# EAGLE design main (EAGLE 6.3)
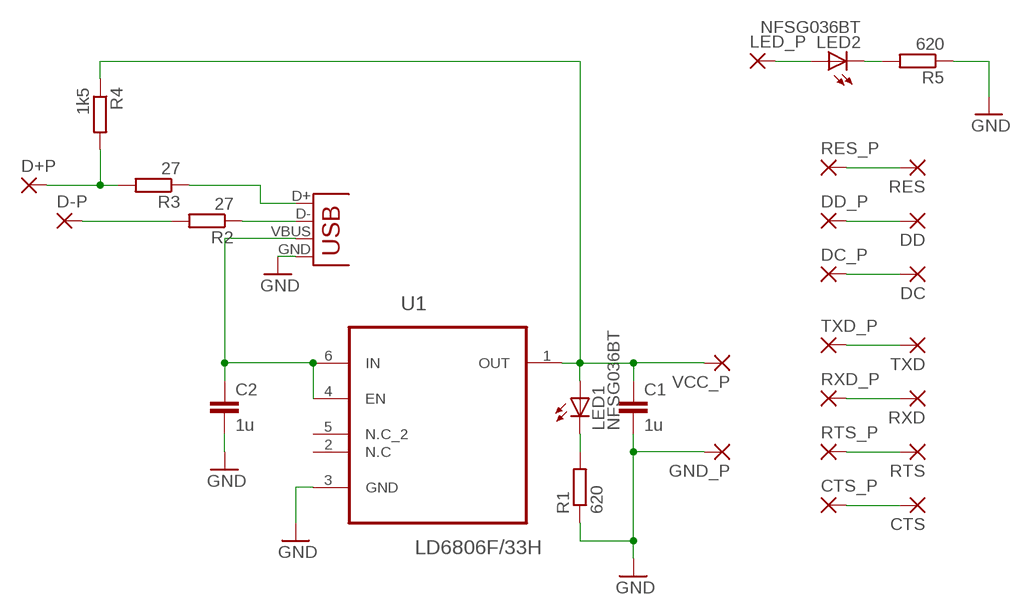
[diagram p0: schematic, sheet 1]

## Parts
C1  1u  C-EUC0805  [C0805]
C2  1u  C-EUC0805  [C0805]
CTS  WIREPAD1,6/0,8  [1,6/0,8]
CTS_P  WIREPAD1,6/0,8  [1,6/0,8]
D+P  WIREPAD1,6/0,8  [1,6/0,8]
D-P  WIREPAD1,6/0,8  [1,6/0,8]
DC  WIREPAD1,6/0,8  [1,6/0,8]
DC_P  WIREPAD1,6/0,8  [1,6/0,8]
DD  WIREPAD1,6/0,8  [1,6/0,8]
DD_P  WIREPAD1,6/0,8  [1,6/0,8]
GND_P  WIREPAD1,6/0,8  [1,6/0,8]
LED1  NFSG036BT  [NFSG036BT]
LED2  NFSG036BT  [NFSG036BT]
LED_P  WIREPAD1,6/0,8  [1,6/0,8]
R1  620  R-EU_R0805  [R0805]
R2  27  R-EU_R0805  [R0805]
R3  27  R-EU_R0805  [R0805]
R4  1k5  R-EU_R0805  [R0805]
R5  620  R-EU_R0805  [R0805]
RES  WIREPAD1,6/0,8  [1,6/0,8]
RES_P  WIREPAD1,6/0,8  [1,6/0,8]
RTS  WIREPAD1,6/0,8  [1,6/0,8]
RTS_P  WIREPAD1,6/0,8  [1,6/0,8]
RXD  WIREPAD1,6/0,8  [1,6/0,8]
RXD_P  WIREPAD1,6/0,8  [1,6/0,8]
TXD  WIREPAD1,6/0,8  [1,6/0,8]
TXD_P  WIREPAD1,6/0,8  [1,6/0,8]
U1  LD6806F/33H  [SON50P100X145X50-6N]
VCC_P  WIREPAD1,6/0,8  [1,6/0,8]
X1  USB-MICROB  [USB-MICROB]

## Nets
3V3: C1.1 LED1.A R4.1 U1.1(OUT) VCC_P.1(P)
5V: C2.1 U1.4(EN) U1.6(IN) X1.VBUS
GND: C1.2 C2.2 GND_P.1(P) R1.1 R5.1 U1.3(GND) X1.GND
N$1: D+P.1(P) R3.2 R4.2
N$2: R3.1 X1.D+
N$3: DD.1(P) DD_P.1(P)
N$4: DC.1(P) DC_P.1(P)
N$5: TXD.1(P) TXD_P.1(P)
N$6: RXD.1(P) RXD_P.1(P)
N$7: RTS.1(P) RTS_P.1(P)
N$8: CTS.1(P) CTS_P.1(P)
N$9: LED1.C R1.2
N$10: R2.1 X1.D-
N$11: D-P.1(P) R2.2
N$12: LED2.A LED_P.1(P)
N$13: LED2.C R5.2
N$14: RES.1(P) RES_P.1(P)
Unconnected: U1.2(N.C) U1.5(N.C_2)

## Library data of the parts
C1 C2 = resistor:C-EU: CAPACITOR, European symbol
CTS CTS_P D+P D-P DC DC_P DD DD_P GND_P LED_P RES RES_P RTS RTS_P RXD RXD_P TXD TXD_P VCC_P = wirepad:WIREPAD: Wire PAD connect wire on PCB
LED1 LED2 = led:NFSG036BT: CHIP TYPE GREEN LED NFSx036xT Source: NICHIA CORPORATION .. NFSG036BT-E.pdf
R1-R5 = resistor:R-EU_: RESISTOR, European symbol
U1 = NXP_By_element14_Batch_1:LD6806F/33H: Ultra low-dropout regulator; MPN: LD6806F/33H; OC_FARNELL: 2057263; OC_NEWARK: 64T3344; PACKAGE: SON-6; SUPPLIER: NXP
X1 = SparkFun:USB: USB Connectors USB-B-PTH is fully proven SKU : PRT-00139 USB-miniB is fully proven SKU : PRT-00587 USB-A-PCB is untested. USB-A-H is throughly reviewed, but untested. Spark Fun Electronics SKU : PRT-00437 USB-B-SMT is throughly reviewed, but untested. Needs silkscreen touching up. USB-A-S has not been used/tested USB-MB-H has not been used/tested

## Board
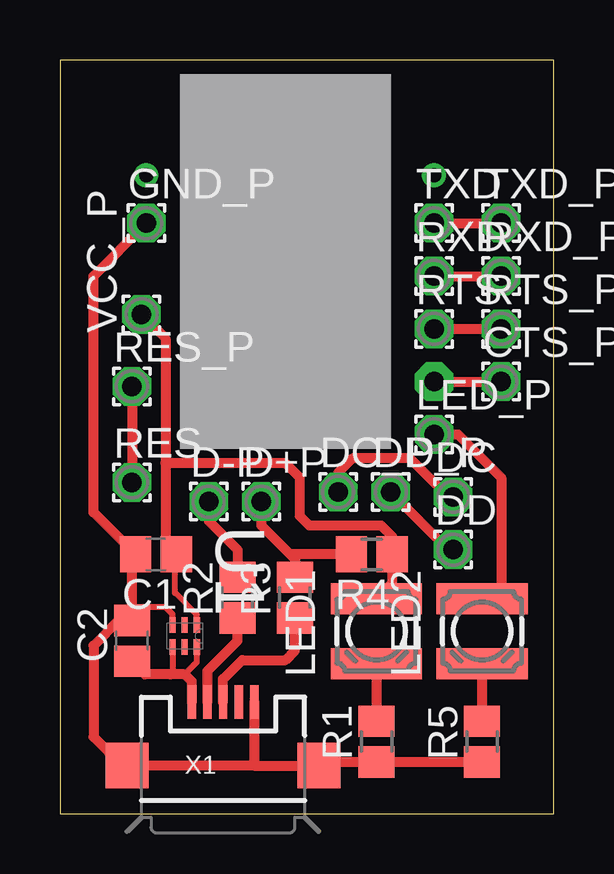
[diagram p1: board, top side]
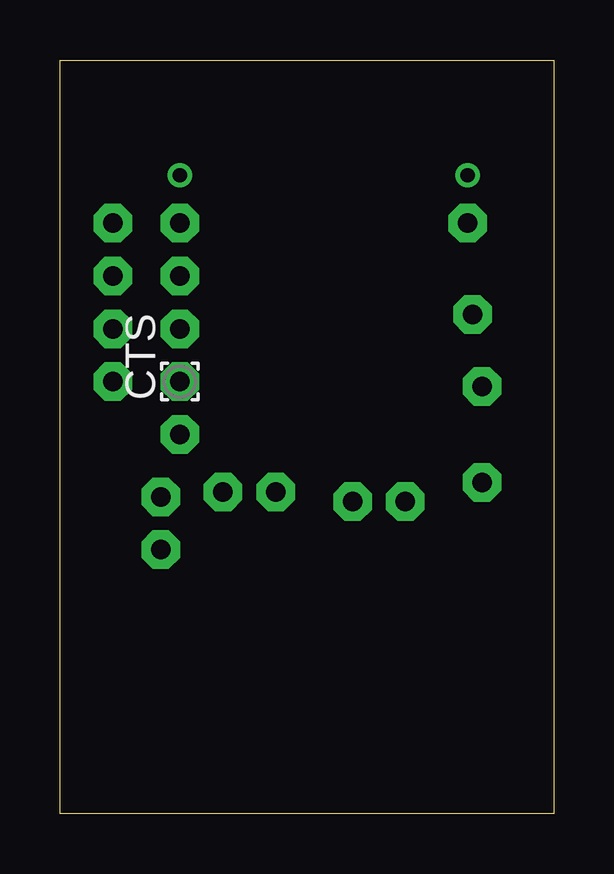
[diagram p2: board, bottom side, seen from below]

Size 20.6 x 31.4 mm. Coordinates in mm from the lower left corner, seen from the top.
Outline: 0,0 20.6,0 20.6,31.4 0,31.4 0,0
Copper layers (1*16): Top 0.035mm / dielectric 1.5mm / Bottom 0.035mm
Design rules "default": minimum track width 10mil, minimum drill 24mil, track to track 8mil, track to pad 8mil, pad to pad 8mil, via to via 8mil, smd to smd 8mil, copper to edge 40mil, drill to drill 8mil, minimum pad ring 10mil, minimum via ring 8mil, stop-mask expansion 4mil, vias tented up to drill 0mil, thermal gap 10mil

### Footprints (pad centres in the part's own frame; a part is rotated, then mirrored left to right if it is on the bottom)
C0805 = smd 1.3 x 1.5: 1 -0.85,0; 2 0.85,0
1,6/0,8 = drill 0.813 pad 1.6 octagon: 1 0,0
NFSG036BT = smd 1.3 x 3.8: A 1.35,0; C -1.35,0
R0805 = smd 1.3 x 1.5: 1 -0.85,0; 2 0.85,0
SON50P100X145X50-6N = smd 0.66 x 0.254: 1 -0.457,0.508; 2 -0.457,0; 3 -0.457,-0.508; 4 0.457,-0.508; 5 0.457,0; 6 0.457,0.508
USB-MICROB = smd 0.35 x 1.4: D+ 0,2.65; D- -0.65,2.65; GND 1.3,2.65; ID 0.65,2.65; VBUS -1.3,2.65 | smd 1.8 x 1.9: MT1 -4,0; MT2 4,0

### Placement (x,y rotation side)
C1  4,10.8 180 top
C2  3,7.2 90 top
CTS  15.6,18 90 bottom
CTS_P  18.4,18 0 top
D+P  8.4,13 0 top
D-P  6.2,13 0 top
DC  16.4,13.2 0 top
DC_P  11.6,13.4 0 top
DD  16.4,11 0 top
DD_P  13.8,13.4 0 top
GND_P  3.6,24.6 0 top
LED1  13.2,7.6 90 top
LED2  17.6,7.6 90 top
LED_P  15.6,15.8 0 top
R1  13.2,3 90 top
R2  7.4,9 90 top
R3  9.8,9 90 top
R4  13,10.8 180 top
R5  17.6,3 90 top
RES  3,13.8 0 top
RES_P  3,17.8 0 top
RTS  15.6,20.2 0 top
RTS_P  18.4,20.2 0 top
RXD  15.6,22.4 0 top
RXD_P  18.4,22.4 0 top
TXD  15.6,24.6 0 top
TXD_P  18.4,24.6 0 top
U1  5.2,7.4 270 top
VCC_P  3.4,20.8 90 top
X1  6.8,2 0 top

### Tracks (layer width: path | path; a pad name or v marks a point on that pad's centre or on a via)
3V3
  Top 0.254: U1.1 5.71,8.29 4.8,9.2 4.8,10.75 C1.1
  Top 0.406: 13.65,9.4 LED1.A 13.85,9.6 R4.1 13.85,11.55 13.4,12 10.4,12 10,12.4 10,14 9.4,14.6 4.4,14.6 | VCC_P.1 4.4,19.8 4.4,14.6 | 4.4,14.6 4.4,11.25 C1.1
5V
  Top 0.254: U1.4 4.69,5.89 4.6,5.8 | U1.6 5.71,6.31 5.2,5.8
  Top 0.406: X1.VBUS 5.5,5.5 5.2,5.8 4.6,5.8 3.55,5.8 C2.1
GND
  Top 0.254: U1.3 4.69,8.31 4.4,8.6 3,8.6
  Top 0.406: X1.GND 8.1,2 | 8.1,2 10.8,2 10.95,2.15 R1.1 R5.1 | 8.1,2 2.6,2 1.4,3.2 1.4,7 2.45,8.05 C2.2 3,8.6 3,10.8 C1.2 1.4,12.55 1.4,22.4 GND_P.1
N$1
  Top 0.406: 9.6,10.8 8.4,12 D+P.1 | 9.6,10.8 9.8,10.6 R3.2 | R4.2 9.6,10.8
N$2
  Top 0.406: X1.D+ 6.8,5.6 7.6,6.4 9.4,6.4 9.8,6.8 R3.1
N$3
  Top 0.406: DD_P.1 16.2,11 DD.1
N$4
  Top 0.406: DC.1 16.2,13.2 14.6,14.8 12.2,14.8 11.6,14.2 DC_P.1
N$5
  Top 0.406: TXD.1 TXD_P.1
N$6
  Top 0.406: RXD.1 RXD_P.1
N$7
  Top 0.406: RTS.1 RTS_P.1
N$8
  Top 0.406: CTS.1 CTS_P.1
N$9
  Top 0.406: LED1.C R1.2
N$10
  Top 0.406: X1.D- 6.15,5.95 7.4,7.2 R2.1
N$11
  Top 0.406: D-P.1 6.2,12.2 7.4,11 R2.2
N$12
  Top 0.406: LED_P.1 16.6,15.8 18.4,14 18.4,8.95 LED2.A
N$13
  Top 0.406: LED2.C R5.2
N$14
  Top 0.406: RES_P.1 RES.1
N$15  (via drill 0.6)
  other vias: 3.6,26.6
N$16  (via drill 0.6)
  other vias: 15.6,26.6